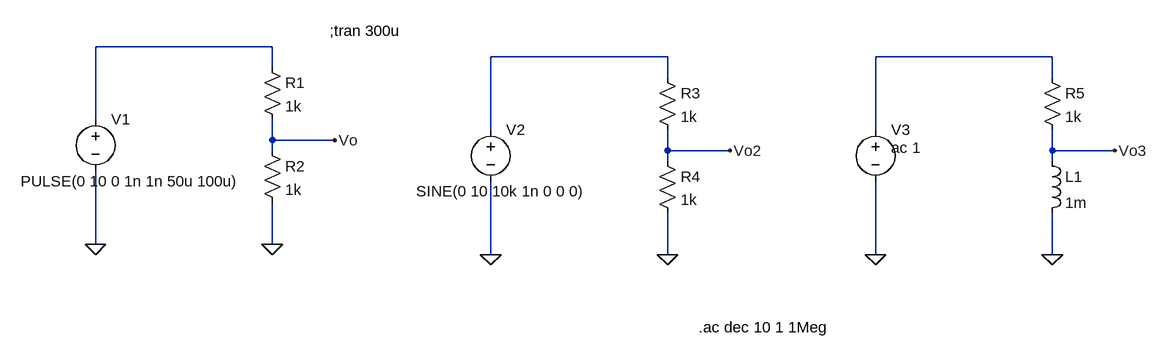
[diagram p0: schematic 04-Sources.asc]
04-Sources.asc, the LTspice schematic file:
Version 4
SHEET 1 1740 680
WIRE 384 16 112 16
WIRE 992 32 720 32
WIRE 1584 32 1312 32
WIRE 384 48 384 16
WIRE 992 64 992 32
WIRE 1584 64 1584 32
WIRE 112 128 112 16
WIRE 720 144 720 32
WIRE 1312 144 1312 32
WIRE 384 160 384 128
WIRE 480 160 384 160
WIRE 384 176 384 160
WIRE 992 176 992 144
WIRE 1088 176 992 176
WIRE 1584 176 1584 144
WIRE 1680 176 1584 176
WIRE 992 192 992 176
WIRE 1584 192 1584 176
WIRE 112 320 112 208
WIRE 384 320 384 256
WIRE 720 336 720 224
WIRE 992 336 992 272
WIRE 1312 336 1312 224
WIRE 1584 336 1584 272
FLAG 384 320 0
FLAG 112 320 0
FLAG 480 160 Vo
FLAG 992 336 0
FLAG 720 336 0
FLAG 1088 176 Vo2
FLAG 1584 336 0
FLAG 1312 336 0
FLAG 1680 176 Vo3
SYMBOL voltage 112 112 R0
WINDOW 3 -115 111 Left 2
WINDOW 123 0 0 Left 0
WINDOW 39 0 0 Left 0
SYMATTR InstName V1
SYMATTR Value PULSE(0 10 0 1n 1n 50u 100u)
SYMBOL res 368 32 R0
SYMATTR InstName R1
SYMATTR Value 1k
SYMBOL res 368 160 R0
SYMATTR InstName R2
SYMATTR Value 1k
SYMBOL voltage 720 128 R0
WINDOW 3 -115 111 Left 2
WINDOW 123 0 0 Left 0
WINDOW 39 0 0 Left 0
SYMATTR InstName V2
SYMATTR Value SINE(0 10 10k 1n 0 0 0)
SYMBOL res 976 48 R0
SYMATTR InstName R3
SYMATTR Value 1k
SYMBOL res 976 176 R0
SYMATTR InstName R4
SYMATTR Value 1k
SYMBOL voltage 1312 128 R0
WINDOW 3 24 44 Left 2
WINDOW 123 0 0 Left 0
WINDOW 39 0 0 Left 0
SYMATTR InstName V3
SYMATTR Value ac 1
SYMBOL res 1568 48 R0
SYMATTR InstName R5
SYMATTR Value 1k
SYMBOL ind 1568 176 R0
SYMATTR InstName L1
SYMATTR Value 1m
TEXT 472 -8 Left 2 !;tran 300u
TEXT 1040 448 Left 2 !.ac dec 10 1 1Meg

The netlist it stands for:
* 04-Sources.asc
V1 N001 0 PULSE(0 10 0 1n 1n 50u 100u)
R1 N001 Vo 1k
R2 Vo 0 1k
V2 N002 0 SINE(0 10 10k 1n 0 0 0)
R3 N002 Vo2 1k
R4 Vo2 0 1k
V3 N003 0 ac 1
R5 N003 Vo3 1k
L1 Vo3 0 1m
;tran 300u
.ac dec 10 1 1Meg
.backanno
.end